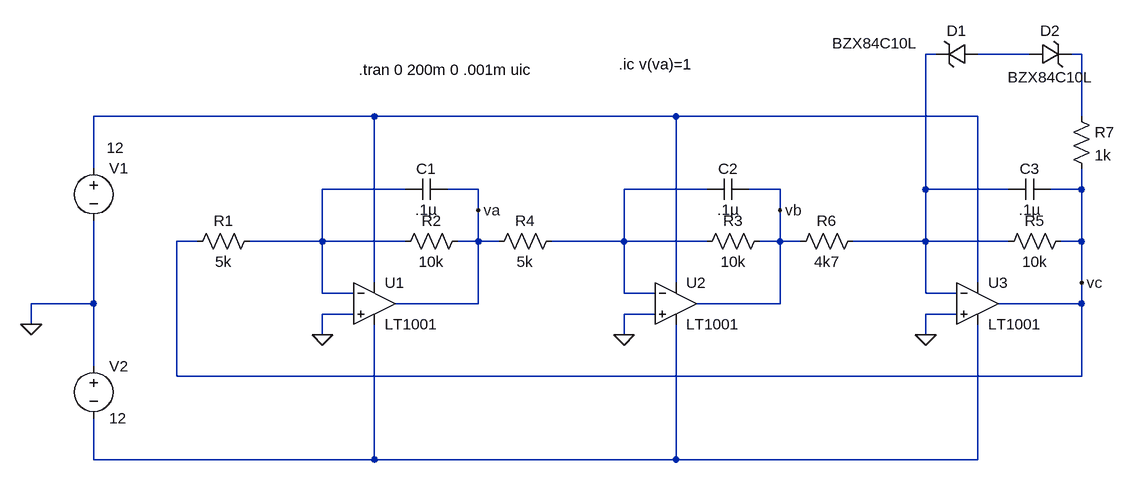
[diagram p0: schematic osctrifasico.asc]
osctrifasico.asc, the LTspice schematic file:
Version 4
SHEET 1 1168 680
WIRE 880 -192 864 -192
WIRE 1024 -192 944 -192
WIRE 1104 -192 1088 -192
WIRE 16 -96 -416 -96
WIRE 480 -96 16 -96
WIRE 944 -96 480 -96
WIRE 1104 -96 1104 -192
WIRE -416 -16 -416 -96
WIRE 64 16 -64 16
WIRE 176 16 128 16
WIRE 528 16 400 16
WIRE 640 16 592 16
WIRE 864 16 864 -192
WIRE 992 16 864 16
WIRE 1104 16 1104 -16
WIRE 1104 16 1056 16
WIRE 176 48 176 16
WIRE 640 48 640 16
WIRE -256 96 -288 96
WIRE -64 96 -64 16
WIRE -64 96 -176 96
WIRE 64 96 -64 96
WIRE 176 96 176 48
WIRE 176 96 144 96
WIRE 208 96 176 96
WIRE 400 96 400 16
WIRE 400 96 288 96
WIRE 528 96 400 96
WIRE 640 96 640 48
WIRE 640 96 608 96
WIRE 672 96 640 96
WIRE 864 96 864 16
WIRE 864 96 752 96
WIRE 992 96 864 96
WIRE 1104 96 1104 16
WIRE 1104 96 1072 96
WIRE 16 160 16 -96
WIRE 480 160 480 -96
WIRE 944 160 944 -96
WIRE 1104 160 1104 96
WIRE -64 176 -64 96
WIRE -16 176 -64 176
WIRE 400 176 400 96
WIRE 448 176 400 176
WIRE 864 176 864 96
WIRE 912 176 864 176
WIRE -416 192 -416 64
WIRE -416 192 -512 192
WIRE 176 192 176 96
WIRE 176 192 48 192
WIRE 640 192 640 96
WIRE 640 192 512 192
WIRE 1104 192 1104 160
WIRE 1104 192 976 192
WIRE -16 208 -64 208
WIRE 448 208 400 208
WIRE 912 208 864 208
WIRE -512 224 -512 192
WIRE -64 240 -64 208
WIRE 400 240 400 208
WIRE 864 240 864 208
WIRE -416 288 -416 192
WIRE -288 304 -288 96
WIRE 1104 304 1104 192
WIRE 1104 304 -288 304
WIRE -416 432 -416 368
WIRE 16 432 16 224
WIRE 16 432 -416 432
WIRE 480 432 480 224
WIRE 480 432 16 432
WIRE 944 432 944 224
WIRE 944 432 480 432
FLAG -64 240 0
FLAG 400 240 0
FLAG 864 240 0
FLAG -512 224 0
FLAG 176 48 va
FLAG 640 48 vb
FLAG 1104 160 vc
SYMBOL Opamps\\LT1001 16 128 R0
SYMATTR InstName U1
SYMBOL res 160 80 R90
WINDOW 0 0 56 VBottom 2
WINDOW 3 32 56 VTop 2
SYMATTR InstName R2
SYMATTR Value 10k
SYMBOL cap 128 0 R90
WINDOW 0 0 32 VBottom 2
WINDOW 3 32 32 VTop 2
SYMATTR InstName C1
SYMATTR Value .1µ
SYMBOL res -160 80 R90
WINDOW 0 0 56 VBottom 2
WINDOW 3 32 56 VTop 2
SYMATTR InstName R1
SYMATTR Value 5k
SYMBOL Opamps\\LT1001 480 128 R0
SYMATTR InstName U2
SYMBOL res 624 80 R90
WINDOW 0 0 56 VBottom 2
WINDOW 3 32 56 VTop 2
SYMATTR InstName R3
SYMATTR Value 10k
SYMBOL cap 592 0 R90
WINDOW 0 0 32 VBottom 2
WINDOW 3 32 32 VTop 2
SYMATTR InstName C2
SYMATTR Value .1µ
SYMBOL res 304 80 R90
WINDOW 0 0 56 VBottom 2
WINDOW 3 32 56 VTop 2
SYMATTR InstName R4
SYMATTR Value 5k
SYMBOL Opamps\\LT1001 944 128 R0
SYMATTR InstName U3
SYMBOL res 1088 80 R90
WINDOW 0 0 56 VBottom 2
WINDOW 3 32 56 VTop 2
SYMATTR InstName R5
SYMATTR Value 10k
SYMBOL cap 1056 0 R90
WINDOW 0 0 32 VBottom 2
WINDOW 3 32 32 VTop 2
SYMATTR InstName C3
SYMATTR Value .1µ
SYMBOL res 768 80 R90
WINDOW 0 0 56 VBottom 2
WINDOW 3 32 56 VTop 2
SYMATTR InstName R6
SYMATTR Value 4k7
SYMBOL voltage -416 -32 R0
WINDOW 3 20 -16 Left 2
WINDOW 123 0 0 Left 2
WINDOW 39 0 0 Left 2
SYMATTR Value 12
SYMATTR InstName V1
SYMBOL voltage -416 272 R0
WINDOW 123 0 0 Left 2
WINDOW 39 0 0 Left 2
SYMATTR InstName V2
SYMATTR Value 12
SYMBOL zener 944 -208 R90
WINDOW 0 -4 32 VBottom 2
WINDOW 3 -16 158 VTop 2
SYMATTR InstName D1
SYMATTR Value BZX84C10L
SYMBOL zener 1024 -176 R270
WINDOW 0 36 32 VTop 2
WINDOW 3 -4 32 VBottom 2
SYMATTR InstName D2
SYMATTR Value BZX84C10L
SYMBOL res 1088 -112 R0
SYMATTR InstName R7
SYMATTR Value 1k
TEXT -8 -168 Left 2 !.tran 0 200m 0 .001m uic
TEXT 392 -176 Left 2 !.ic v(va)=1

The netlist it stands for:
* osctrifasico.asc
XU1 0 N005 N004 N007 va LT1001  ; pins In+ In- V+ V- OUT
R2 va N005 10k
C1 va N005 .1µ
R1 N005 vc 5k
XU2 0 N006 N004 N007 vb LT1001  ; pins In+ In- V+ V- OUT
R3 vb N006 10k
C2 vb N006 .1µ
R4 N006 va 5k
XU3 0 N001 N004 N007 vc LT1001  ; pins In+ In- V+ V- OUT
R5 vc N001 10k
C3 vc N001 .1µ
R6 N001 vb 4k7
V1 N004 0 12
V2 0 N007 12
D1 N002 N001 BZX84C10L
D2 N002 N003 BZX84C10L
R7 N003 vc 1k
.model D D
.lib standard.dio
.tran 0 200m 0 .001m uic
.ic v(va)=1
.lib LTC.lib
.backanno
.end